# EAGLE design tvbgone-attiny85 (EAGLE 5.11)
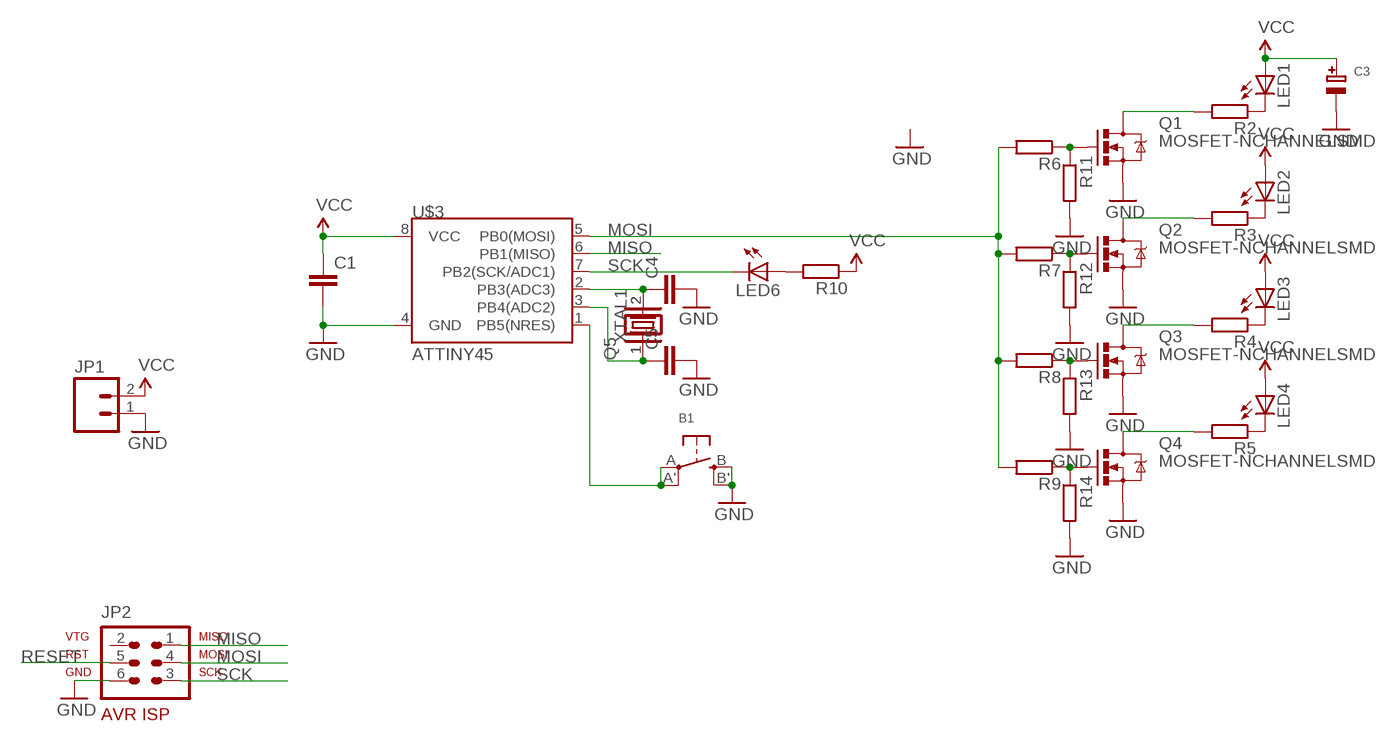
[diagram p0: schematic, sheet 1]

## Parts
B1  SWITCH_TACT_SMT  [EVQ-Q2]
C1  C-EUC0603  [C0603]
C3  CAP_TANTALUMD/7343_WAVE  [EIA7343-31/D-W]
C4  C-EUC0805  [C0805]
C5  C-EUC0805  [C0805]
JP1  M02PTH3  [1X02_LONGPADS]
JP2  AVR-ISP-6  [AVR-ISP-6]
LED1  LED5MM  [LED5MM]
LED2  LED5MM  [LED5MM]
LED3  LED5MM  [LED5MM]
LED4  LED5MM  [LED5MM]
LED6  LEDCHIPLED_0805  [CHIPLED_0805]
Q1  MOSFET-NCHANNELSMD  [SOT23-3]
Q2  MOSFET-NCHANNELSMD  [SOT23-3]
Q3  MOSFET-NCHANNELSMD  [SOT23-3]
Q4  MOSFET-NCHANNELSMD  [SOT23-3]
Q5  XTAL/S  [QS]
R2  R-EU_R0805  [R0805]
R3  R-EU_R0805  [R0805]
R4  R-EU_R0805  [R0805]
R5  R-EU_R0805  [R0805]
R6  R-EU_R0805  [R0805]
R7  R-EU_R0805  [R0805]
R8  R-EU_R0805  [R0805]
R9  R-EU_R0805  [R0805]
R10  R-EU_R0805  [R0805]
R11  R-EU_R0805  [R0805]
R12  R-EU_R0805  [R0805]
R13  R-EU_R0805  [R0805]
R14  R-EU_R0805  [R0805]
U$3  ATTINY45  [SO08-EIAJ]
XTAL1  OSC-XTAL-HC-49U-SMD  [HC-49U]

## Nets
GND: B1.B'(S1) B1.B(S) C1.2 C3.- C4.2 C5.2 JP1.1 JP2.6 Q1.2(S) Q2.2(S) Q3.2(S) Q4.2(S) R11.2 R12.2 R13.2 R14.2 U$3.4(GND)
MISO: JP2.1 U$3.6(PB1(MISO))
MOSI: JP2.4 R6.2 R7.2 R8.2 R9.2 U$3.5(PB0(MOSI))
N$1: LED1.K(C) R2.1
N$2: LED2.K(C) R3.1
N$3: LED3.K(C) R4.1
N$4: LED4.K(C) R5.1
N$5: Q1.1(G) R6.1 R11.1
N$6: Q2.1(G) R7.1 R12.1
N$7: Q3.1(G) R8.1 R13.1
N$8: Q4.1(G) R9.1 R14.1
N$9: Q1.3(D) R2.2
N$10: Q2.3(D) R3.2
N$11: Q3.3(D) R4.2
N$12: Q4.3(D) R5.2
N$13: LED6.A R10.2
N$15: C4.1 Q5.2 U$3.2(PB3(ADC3)) XTAL1.2
N$16: C5.1 Q5.1 U$3.3(PB4(ADC2)) XTAL1.1
RESET: B1.A'(P1) B1.A(P) JP2.5 U$3.1(PB5(NRES))
SCK: JP2.3 LED6.C U$3.7(PB2(SCK/ADC1))
VCC: C1.1 C3.+ JP1.2 LED1.A LED2.A LED3.A LED4.A R10.1 U$3.8(VCC)
Unconnected: JP2.2

## Library data of the parts
B1 = microbuilder:SWITCH_TACT_SMT: SMT Tact Switches 6x6mm - Digikey: P12940SCT-ND KMR2 (4.6x2.8mm) - Digikey: 401-1426-1-ND EVQ-PQHB55 - Light Touch, 160GF (4.5x4.5mm) - Digikey: P8090SCT-ND
C1 C4 C5 = rcl:C-EU: CAPACITOR, European symbol
C3 = microbuilder:CAP_TANTALUM: Tantalum Capacitors Wave footprints have larger pads and are meant to be used for hand soldering. Reflow footprints are optimised for solder paste and a reflow oven. EIA3216-18/A-[R/W] - Size A / 3216-18 / 1206 footprint 4.7µF 25V 10% Tantalum Capacitor 10µF 16V 10% Tantalum Capacitor [Digikey: 495-2236-2-ND] EIA3528-21/B-[R/W] - Size B / 3528-21 47µF 10V 10% Tantalum Capactior [Digikey: 495-2216-1-ND] EIA6032-28/C-[R/W] - Size C / 6032-28 10µF 35V 20% Tantalum Capacitor [Digikey: 495-2285-1-ND] 100µF 16V 10% Tantalum Capactior [Digikey: 399-5214-1-ND]
JP1 = SparkFun:M02: Header 2 Standard 2-pin 0.1" header. Use with straight break away headers (SKU : PRT-00116), right angle break away headers (PRT-00553), swiss pins (PRT-00743), machine pins (PRT-00117), and female headers (PRT-00115). Molex polarized connector foot print use with SKU : PRT-08233 with associated crimp pins and housings.
JP2 = avr-5:AVR-ISP-6: AVR ISP-6 Serial Programming Header
LED1-LED4 = SparkFun:LED: LEDs Standard schematic elements and footprints for 5mm, 3mm, 1206, and 0603 sized LEDs. 5mm - Spark Fun Electronics SKU : COM-00529 (and others)
LED6 = adafruit:LED: LED OSRAM: - CHIPLED LG R971, LG N971, LY N971, LG Q971, LY Q971, LO R971, LY R971 LH N974, LH R974 LS Q976, LO Q976, LY Q976 LO Q996 - Hyper CHIPLED LW Q18S LB Q993, LB Q99A, LB R99A - SideLED LS A670, LO A670, LY A670, LG A670, LP A670 LB A673, LV A673, LT A673, LW A673 LH A674 LY A675 LS A676, LA A676, LO A676, LY A676, LW A676 LS A679, LY A679, LG A679 - Hyper Micro SIDELED® LS Y876, LA Y876, LO Y876, LY Y876 LT Y87S - SmartLED LW L88C, LW L88S LB L89C, LB L89S, LG L890 LS L89K, LO L89K, LY L89K LS L896, LA L896, LO L896, LY L896 - TOPLED LS T670, LO T670, LY T670, LG T670, LP T670 LSG T670, LSP T670, LSY T670, LOP T670, LYG T670 LG T671, LOG T671, LSG T671 LB T673, LV T673, LT T673, LW T673 LH T674 LS T676, LA T676, LO T676, LY T676, LB T676, LH T676, LSB T676, LW T676 LB T67C, LV T67C, LT T67C, LS T67K, LO T67K, LY T67K, LW E67C LS E67B, LA E67B, LO E67B, LY E67B, LB E67C, LV E67C, LT E67C LW T67C LS T679, LY T679, LG T679 LS T770, LO T770, LY T770, LG T770, LP T770 LB T773, LV T773, LT T773, LW T773 LH T774 LS E675, LA E675, LY E675, LS T675 LS T776, LA T776, LO T776, LY T776, LB T776 LHGB T686 LT T68C, LB T68C - Hyper Mini TOPLED® LB M676 - Mini TOPLED Santana® LG M470 LS M47K, LO M47K, LY M47K Source: http://www.osram.convergy.de/
Q1-Q4 = SparkFun:MOSFET-NCHANNEL
Q5 = special:XTAL/S: CRYSTAL
R2-R14 = rcl:R-EU_: RESISTOR, European symbol
U$3 = SparkFun:ATTINY45: Atmel ATTiny45
XTAL1 = dp_devices:OSC-XTAL

## Board
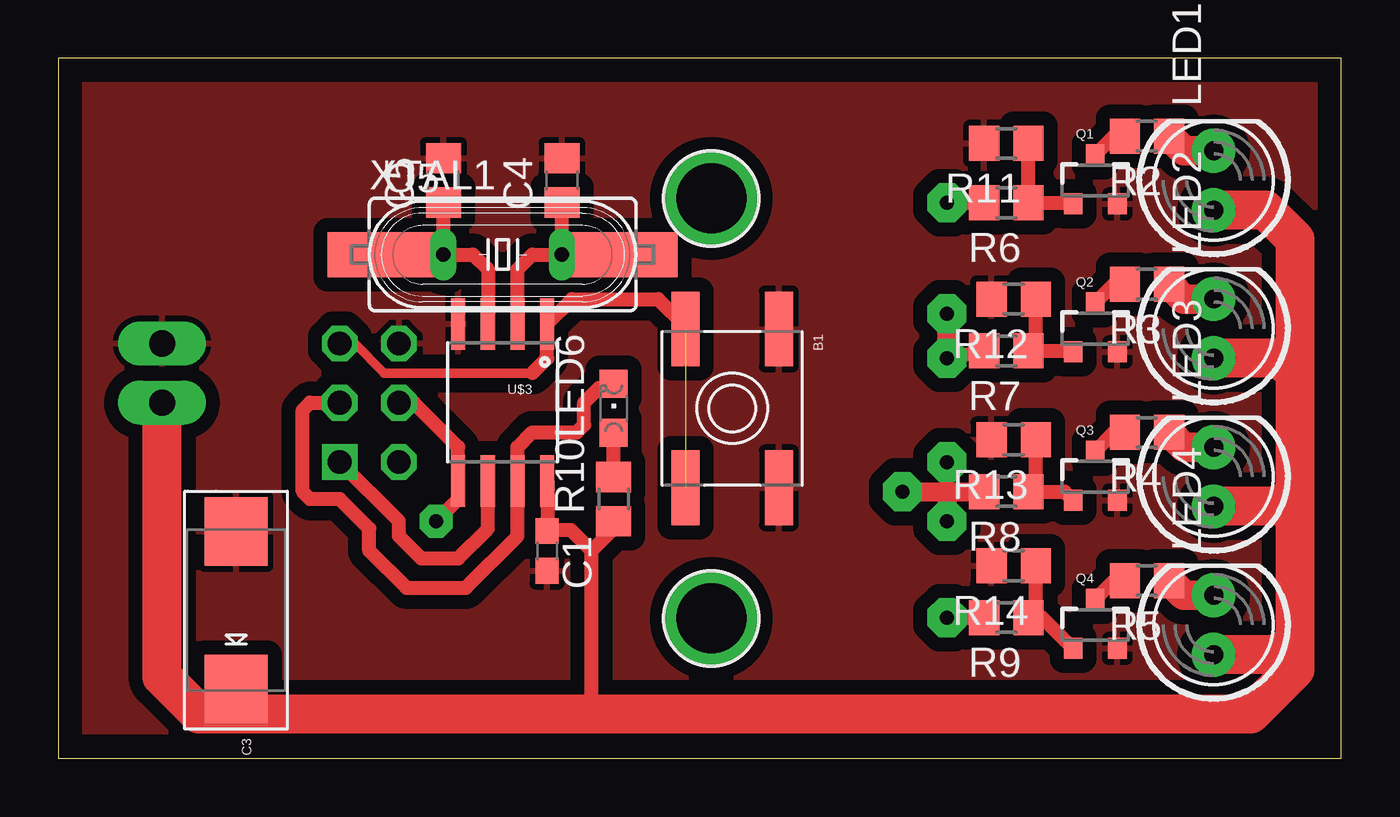
[diagram p1: board, top side]
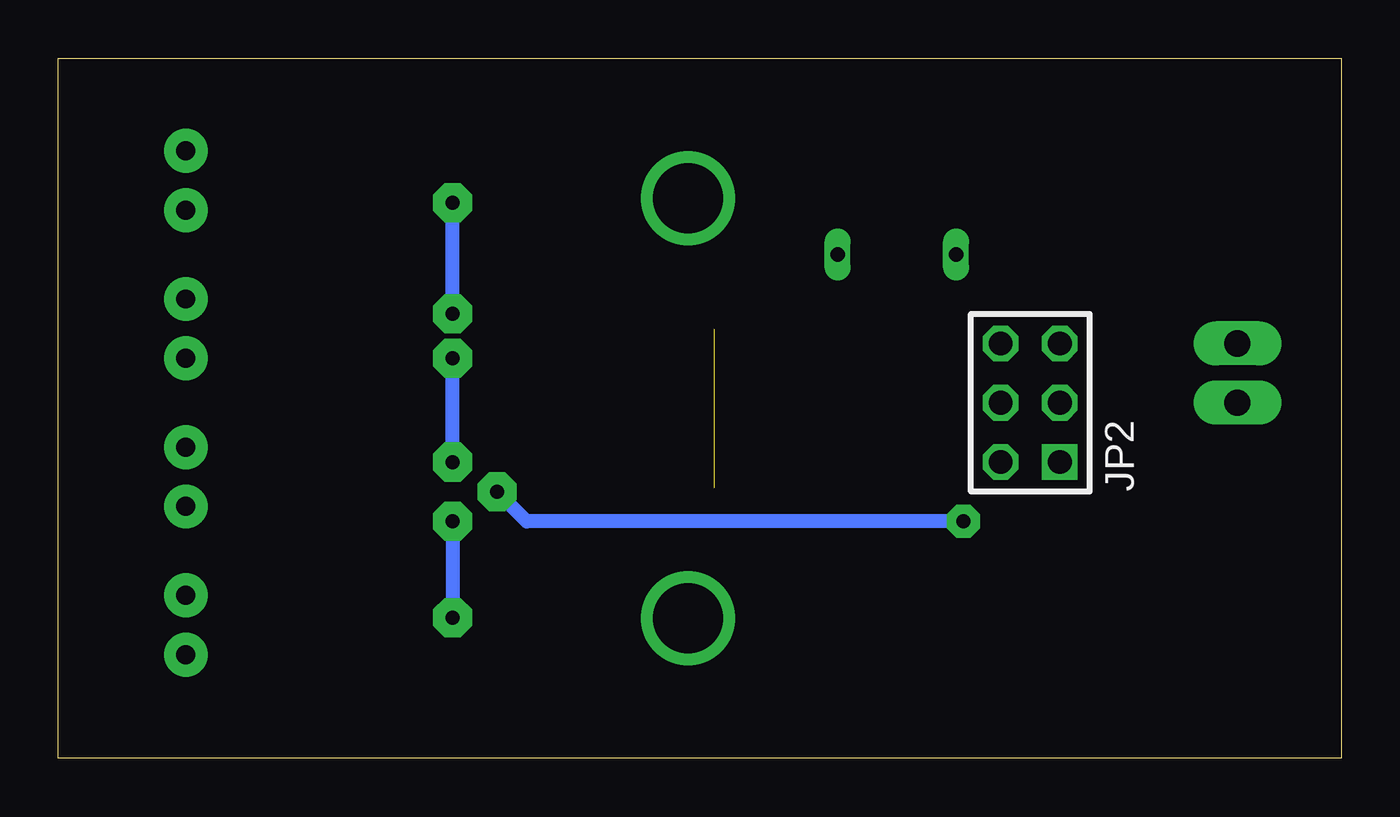
[diagram p2: board, bottom side, seen from below]

Size 55 x 30 mm. Coordinates in mm from the lower left corner, seen from the top.
Outline: 0,0 55,0 55,30 0,30 0,0
Copper layers (1*16): Top 0.035mm / dielectric 1.5mm / Bottom 0.035mm
Design rules "default": minimum track width 10mil, minimum drill 24mil, track to track 8mil, track to pad 8mil, pad to pad 8mil, via to via 8mil, smd to smd 8mil, copper to edge 40mil, drill to drill 8mil, minimum pad ring 10mil, minimum via ring 8mil, stop-mask expansion 4mil, vias tented up to drill 0mil, thermal gap 10mil

### Footprints (pad centres in the part's own frame; a part is rotated, then mirrored left to right if it is on the bottom)
EVQ-Q2 = smd 3.2 x 1.2: A -3.4,-2; A' 3.4,-2; B -3.4,2; B' 3.4,2
C0603 = smd 1.1 x 1: 1 -0.85,0; 2 0.85,0
EIA7343-31/D-W = smd 2.95 x 2.7: + 3.375,0; - -3.375,0
C0805 = smd 1.3 x 1.5: 1 -0.95,0; 2 0.95,0
1X02_LONGPADS = drill 1.118 pad 1.88 long: 1 0,0; 2 2.54,0
AVR-ISP-6 = drill 1.016 square: 1 -2.54,-1.27 | drill 1.016 octagon: 2 -2.54,1.27; 3 0,-1.27; 4 0,1.27; 5 2.54,-1.27; 6 2.54,1.27
LED5MM = drill 0.813 pad 1.88 round: A -1.27,0; K 1.27,0
CHIPLED_0805 = smd 1.2 x 1.2: A 0,-1.05; C 0,1.05
SOT23-3 = smd 0.8 x 0.9: 1 -0.95,-1; 2 0.95,-1; 3 0,1.1
QS = drill 0.61 long: 1 -2.54,0; 2 2.54,0
R0805 = smd 1.3 x 1.5: 1 -0.95,0; 2 0.95,0
MOUNTINGHOLE_3.0_PLATEDTHIN = drill 3 pad 3.6 round: P$1 0,0
SO08-EIAJ = smd 0.61 x 2.21: 1 -1.905,-3.378; 2 -0.635,-3.378; 3 0.635,-3.378; 4 1.905,-3.378; 5 1.905,3.353; 6 0.635,3.353; 7 -0.635,3.353; 8 -1.905,3.353
HC-49U = smd 5.334 x 1.93: 1 -4.826,0; 2 4.826,0

### Placement (x,y rotation side)
B1  28.89,15 270 top
C1  20.95,8.89 270 top
C3  7.62,6.35 270 top
C4  21.59,24.77 90 top
C5  16.51,24.77 90 top
JP1  4.45,17.78 270 top
JP2  13.34,15.24 90 bottom
LED1  49.53,24.77 90 top
LED2  49.53,18.41 90 top
LED3  49.53,12.06 90 top
LED4  49.53,5.71 90 top
LED6  23.81,15 0 top
Q1  44.45,24.77 0 top
Q2  44.45,18.41 0 top
Q3  44.45,12.06 0 top
Q4  44.45,5.71 0 top
Q5  19.05,21.59 0 top
R2  46.67,26.67 180 top
R3  46.67,20.32 180 top
R4  46.67,13.97 180 top
R5  46.67,7.62 180 top
R6  40.64,23.81 180 top
R7  40.64,17.46 180 top
R8  40.64,11.43 180 top
R9  40.64,6.03 180 top
R10  23.81,11.11 90 top
R11  40.64,26.35 180 top
R12  40.96,19.68 180 top
R13  40.96,13.65 180 top
R14  40.96,8.26 180 top
U$1  [MOUNTINGHOLE_3.0_PLATEDTHIN]  28,6 0 top
U$2  [MOUNTINGHOLE_3.0_PLATEDTHIN]  28,24 0 top
U$3  19.05,15.24 180 top
XTAL1  19.05,21.59 0 top

### Tracks (layer width: path | path; a pad name or v marks a point on that pad's centre or on a via)
GND
  pour Top (isolate 0.61): 0,30.48 0,0 54.61,0 54.61,30.48
MISO
  Top 0.61: JP2.1 14.61,10.16 14.61,9.53 15.56,8.57 17.14,8.57 18.41,9.84 U$3.6
MOSI  (via drill 0.6 pad 1.42, 0.6 pad 1.68)
  Top 0.61: v38.1,6.03 R9.2 | v38.1,17.14 R7.2 | 38.1,11.43 v38.1,12.7 | v38.1,23.81 R6.2 | v16.19,10.16 17.14,11.11 U$3.5 17.14,13.34 15.24,15.24 JP2.4
  Top 0.813: v36.2,11.43 38.1,11.43 | 38.1,11.43 R8.2 | 38.1,11.43 v38.1,10.16 | v38.1,17.14 v38.1,19.05
  Bottom 0.61: v38.1,10.16 v38.1,6.03 | v38.1,12.7 v38.1,17.14 | v38.1,19.05 v38.1,23.81 | v36.2,11.43 34.92,10.16 v16.19,10.16
N$1
  Top 1.27: LED1.K 48.26,26.04 R2.1
N$2
  Top 1.27: LED2.K 48.26,19.68 R3.1
N$3
  Top 1.27: LED3.K 48.26,13.34 R4.1
N$4
  Top 1.27: LED4.K 48.26,6.99 R5.1
N$5
  Top 0.61: Q1.1 43.45,23.81 R6.1 R11.1
N$6
  Top 0.61: Q2.1 43.45,17.46 R7.1 41.91,17.78 R12.1
N$7
  Top 0.61: Q3.1 43.13,11.43 R8.1 41.91,11.75 R13.1
N$8
  Top 0.61: Q4.1 42.18,6.03 R9.1 41.91,6.35 R14.1
N$9
  Top 0.61: R2.2 45.26,26.67 Q1.3
N$10
  Top 0.61: R3.2 45.26,20.32 Q2.3
N$11
  Top 0.61: R4.2 45.26,13.97 Q3.3
N$12
  Top 0.61: R5.2 45.26,7.62 Q4.3
N$13
  Top 0.61: R10.2 LED6.A
N$15
  Top 0.61: U$3.2 19.68,20.95 20.32,21.59 Q5.2 | Q5.2 C4.1 | Q5.2 XTAL1.2
N$16
  Top 0.61: U$3.3 18.41,20.95 17.78,21.59 Q5.1 | Q5.1 C5.1 | XTAL1.1 Q5.1
RESET  (1 unrouted)
  Top 0.406: JP2.5 12.7,17.78 13.97,16.51 20.32,16.51
  Top 0.61: 20.32,16.51 20.95,17.14 U$3.1 22.02,19.68 25.72,19.68 26.89,18.51 B1.A
SCK
  Top 0.61: JP2.3 10.79,15.24 10.48,14.92 10.48,11.43 10.79,11.11 12.06,11.11 13.34,9.84 13.34,8.89 14.92,7.3 17.46,7.3 19.68,9.53 U$3.7 19.68,13.34 20.32,13.97 22.23,13.97 22.54,14.29 22.54,15.24 23.18,15.88 23.64,15.88 LED6.C
VCC
  Top 0.61: U$3.8 20.99,11.85 20.99,9.78 | 20.99,9.78 C1.1 | 20.99,9.78 21.97,9.78 22.86,8.89 | 22.86,1.91 22.86,8.89 | 7.62,1.91 C3.+ | R10.1 23.81,9.84 22.86,8.89
  Top 1.676: JP1.2 4.45,3.49 6.03,1.91 7.62,1.91 22.86,1.91 51.12,1.91 53.02,3.81 53.02,5.08 | 53.02,5.08 53.02,11.43 | 53.02,11.43 53.02,16.51 | 53.02,16.51 53.02,22.23 51.75,23.5 LED1.A | LED2.A 52.39,17.14 53.02,16.51 | LED3.A 52.39,10.79 53.02,11.43 | LED4.A 52.39,4.45 53.02,5.08